# EAGLE schematic Center panel V2 (EAGLE 8.5.0)
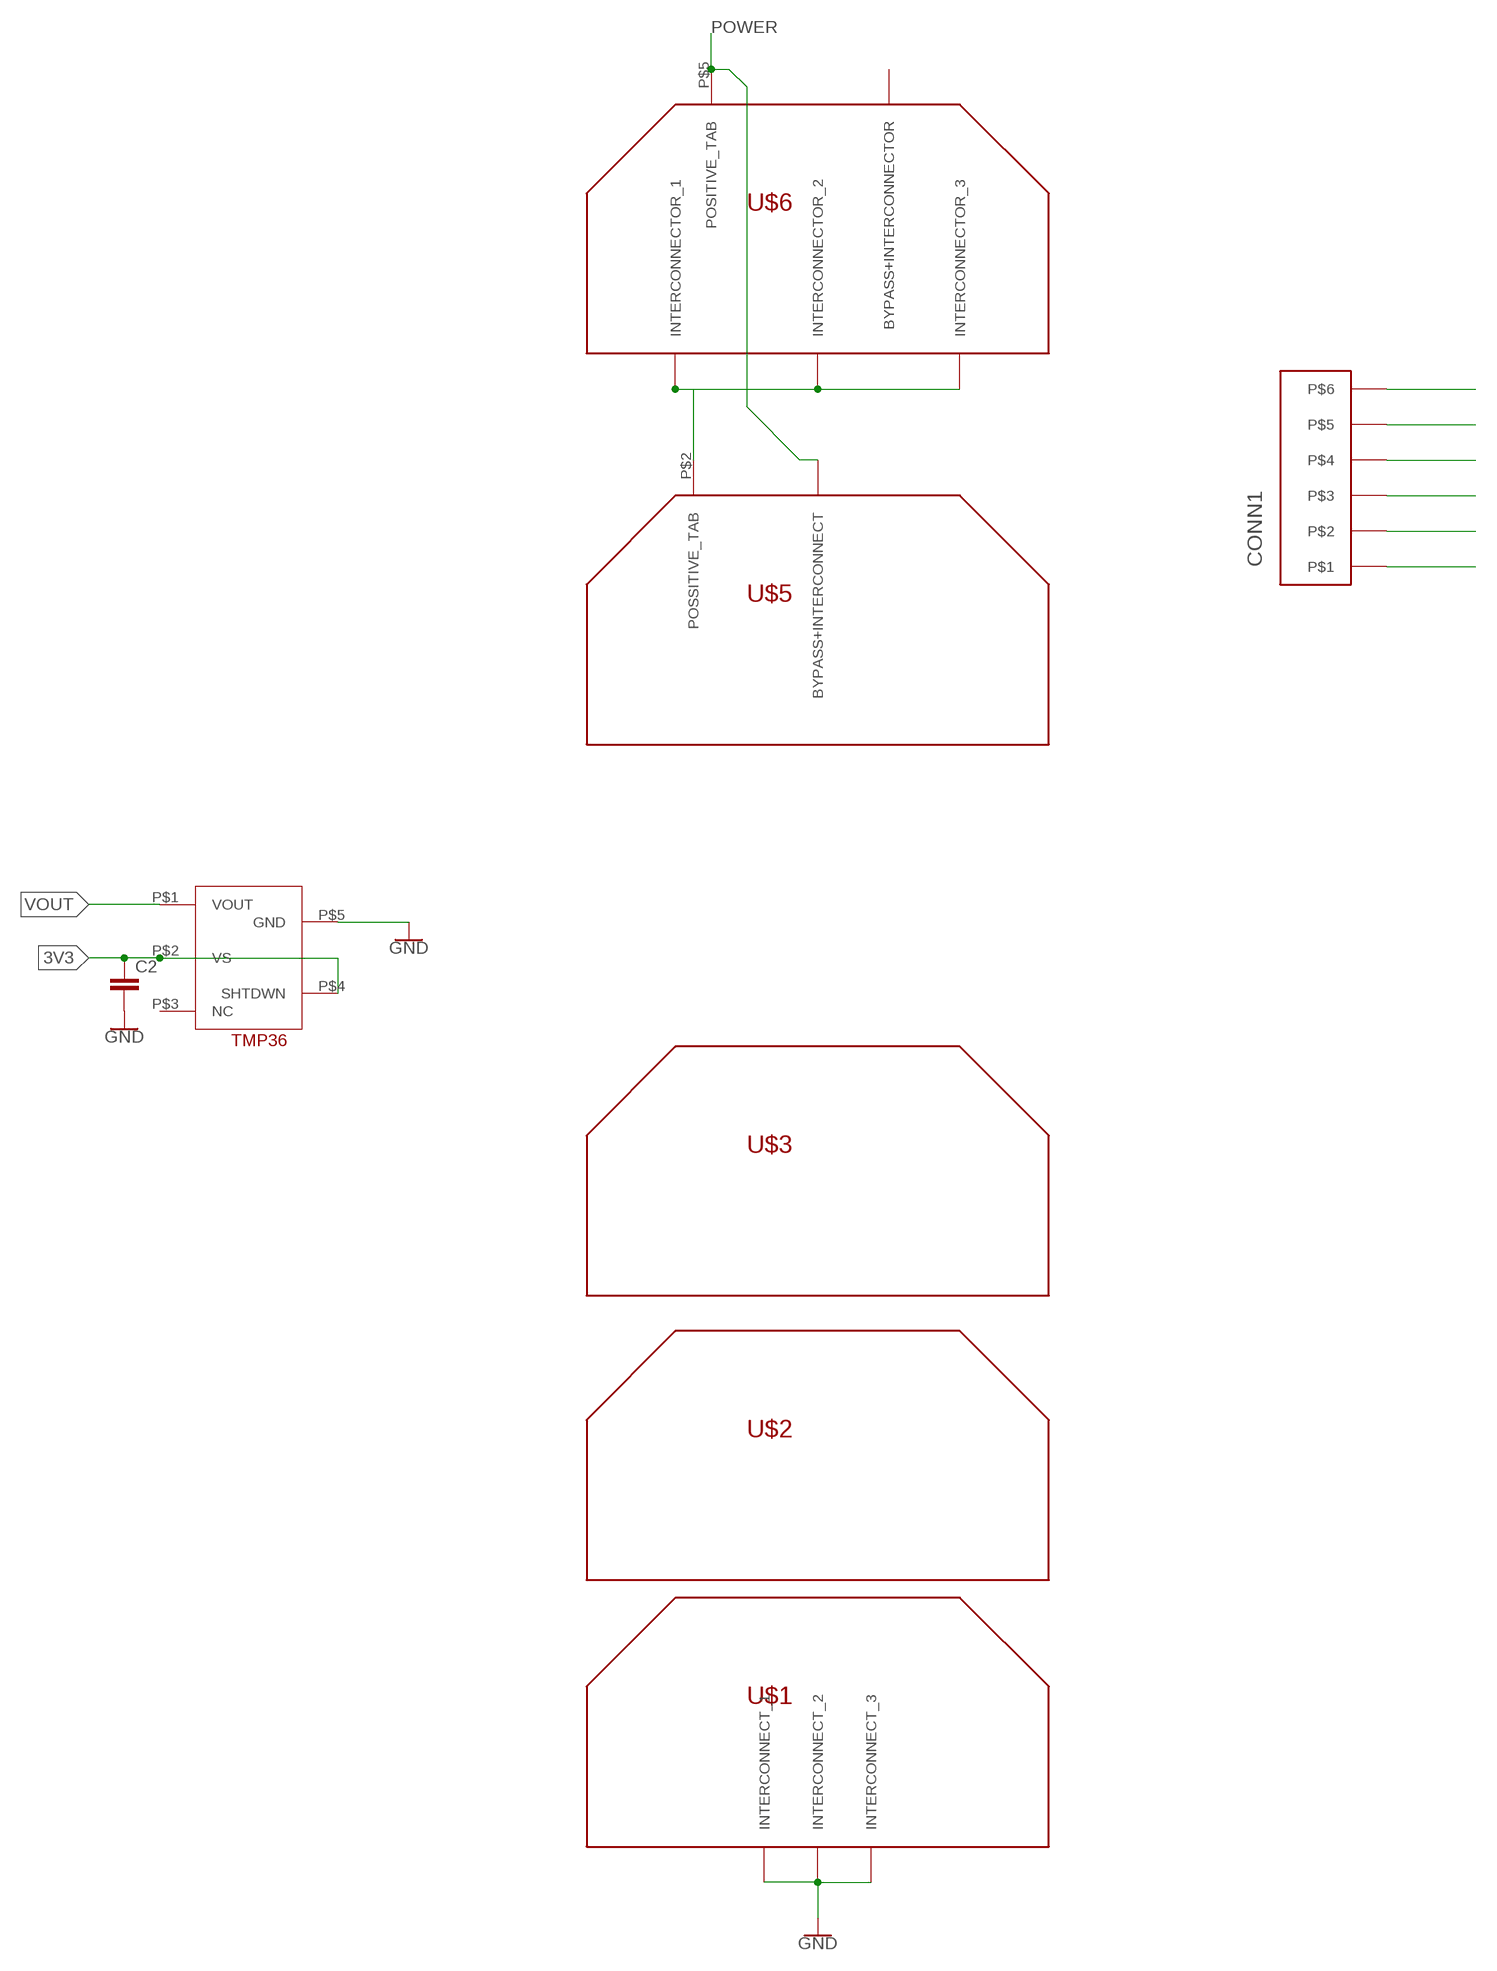
[diagram p0: schematic, sheet 1]

## Parts
C2  CAPACITOR0805  [0805]
CONN1  PICOLOCK_6  [PICOLOCK_6]
U$1  SOLAR_CELL_BOTTOM  [SOLAR_CELL_BOTTOM_SHORT-PADS]
U$2  SOALAR_CELL_OUTLINE  [SOLAR_CELL_OUTLINE]
U$3  SOALAR_CELL_OUTLINE  [SOLAR_CELL_OUTLINE]
U$5  SOLAR_CELL_TOP  [SOLAR_CELL_TOP_SHORT-PAD]
U$6  SOLAR_CELL_STAND-ALONE  [SOLAR_CELL_STAND-ALONE]
U$7  TMP36  [SOT-23-5]

## Nets
3V3: C2.1 CONN1.P$3 U$7.P$2(VS) U$7.P$4(SHTDWN)
GND: CONN1.P$2 CONN1.P$5 U$1.P$1(INTERCONNECT_1) U$1.P$2(INTERCONNECT_2) U$1.P$3(INTERCONNECT_3) U$7.P$5(GND)
N$7: U$5.P$2(POSSITIVE_TAB) U$6.P$1(INTERCONNECTOR_1) U$6.P$2(INTERCONNECTOR_2) U$6.P$3(INTERCONNECTOR_3)
POWER: CONN1.P$1 CONN1.P$6 U$5.P$1(BYPASS+INTERCONNECT) U$6.P$5(POSITIVE_TAB)
VOUT: CONN1.P$4 U$7.P$1(VOUT)
Unconnected: C2.2 U$6.P$4(BYPASS+INTERCONNECTOR) U$7.P$3(NC)

## Library data of the parts
C2 = DubSat1 Components:CAPACITOR: Capacitor Standard 0603 ceramic capacitor, and 0.1" leaded capacitor.
CONN1 = DubSat1 Components:PICOLOCK_6
U$1 = DubSat1 Components:SOLAR_CELL_BOTTOM: Azurspace Solar cell: http://www.azurspace.com/images/products/0003401-01-01_DB_3G30A.pdf Contains an outline of the cell with pads on the bottom for the main interconnectors. To be used as the bottom cell in a string of cells.
U$2 U$3 = DubSat1 Components:SOALAR_CELL_OUTLINE: Azurspace Solar Cell: http://www.azurspace.com/images/products/0003401-01-01_DB_3G30A.pdf Contains an outline of the solar cell without any pads because the interconnectors will be attached externaly and not on the board. This footprint is to be used as the center cells in a string of cells.
U$5 = DubSat1 Components:SOLAR_CELL_TOP: Azurspace solar cell: http://www.azurspace.com/images/products/0003401-01-01_DB_3G30A.pdf With outline of full cell + pad for top side introconnector and integrated bypass diode. To be used as the top cell in a string of cells.
U$6 = DubSat1 Components:SOLAR_CELL_STAND-ALONE
U$7 = DubSat1 Components:TMP36